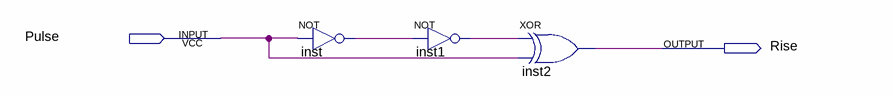
[diagram p0: schematic sheet]
// Quartus schematic RisingEdgeDetector.bdf as structural Verilog: 3 symbols, 2 pins
module RisingEdgeDetector (
  input  Pulse,
  output Rise
);

  wire inst1_out, inst_out;

  not inst (inst_out, Pulse);
  not inst1 (inst1_out, inst_out);
  xor inst2 (Rise, inst1_out, Pulse);
endmodule
